# EAGLE design RobotArm4 (EAGLE 4.16)
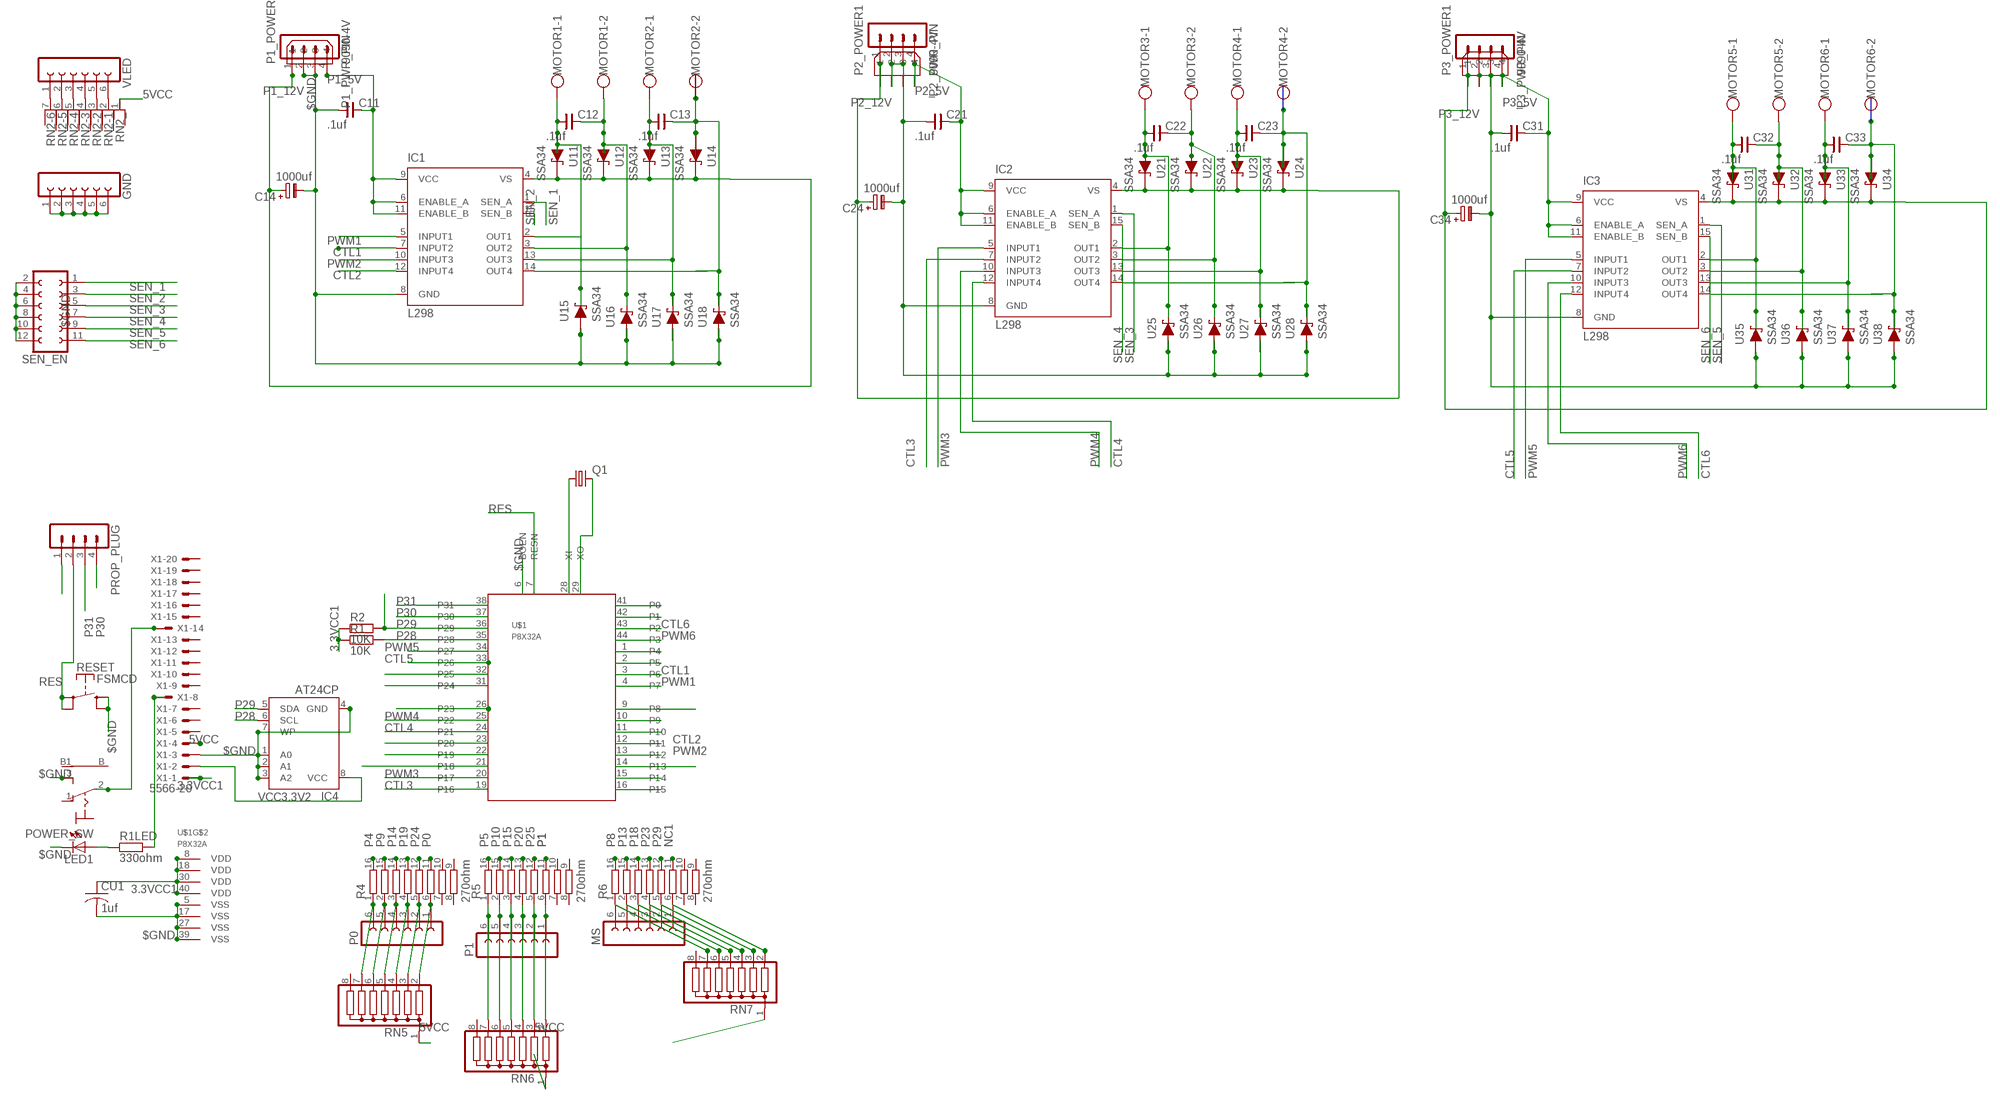
[diagram p0: schematic, sheet 1]

## Parts
C11  .1uf  CNP-1206  [1206]
C12  .1uf  CNP-1206  [1206]
C13  .1uf  CNP-1206  [1206]
C14  1000uf  C-PR-SMD-SV-C  [SV-C]
C21  .1uf  CNP-1206  [1206]
C22  .1uf  CNP-1206  [1206]
C23  .1uf  CNP-1206  [1206]
C24  1000uf  C-PR-SMD-SV-C  [SV-C]
C31  .1uf  CNP-1206  [1206]
C32  .1uf  CNP-1206  [1206]
C33  .1uf  CNP-1206  [1206]
C34  1000uf  C-PR-SMD-SV-C  [SV-C]
CU1  1uf  C-USC1206  [C1206]
GND  FE06-1  [FE06]
IC1  L298  [MULTIWATT-15]
IC2  L298  [MULTIWATT-15]
IC3  L298  [MULTIWATT-15]
IC4  AT24CP  [DIL08]
LED1  LED5MM  [LED5MM]
MOTOR1  W237-102  [W237-102]
MOTOR2  W237-102  [W237-102]
MOTOR3  W237-102  [W237-102]
MOTOR4  W237-102  [W237-102]
MOTOR5  W237-102  [W237-102]
MOTOR6  W237-102  [W237-102]
MS  FE06-1  [FE06]
P0  FE06-1  [FE06]
P1  FE06-1  [FE06]
P1_POWER  9090-4V  [9090-4V]
P1_PWR_PIN  MA04-1  [MA04-1]
P2_POWER1  9090-4V  [9090-4V]
P2_PWR_PIN  MA04-1  [MA04-1]
P3_POWER1  9090-4V  [9090-4V]
P3_PWR_PIN  MA04-1  [MA04-1]
POWER_SW  9070-1W  [9070-1W]
PROP_PLUG  MA04-1  [MA04-1]
Q1  CRYSTALHC49S  [HC49/S]
R1  10K  RESISTOR_1206  [RESC3115X70N]
R1LED  330ohm  RESISTOR_1206  [RESC3115X70N]
R2  10K  RESISTOR_1206  [RESC3115X70N]
R4  270ohm  2NBS16-8  [SO16]
R5  270ohm  2NBS16-8  [SO16]
R6  270ohm  2NBS16-8  [SO16]
RESET  FSMCD  [FSMCD]
RN2  RNX6  [RN-7]
RN5  G07R  [SIL8]
RN6  G07R  [SIL8]
RN7  G07R  [SIL8]
SEN_EN  FE06-2  [FE06-2]
U11  SSA34  [SMA]
U12  SSA34  [SMA]
U13  SSA34  [SMA]
U14  SSA34  [SMA]
U15  SSA34  [SMA]
U16  SSA34  [SMA]
U17  SSA34  [SMA]
U18  SSA34  [SMA]
U21  SSA34  [SMA]
U22  SSA34  [SMA]
U23  SSA34  [SMA]
U24  SSA34  [SMA]
U25  SSA34  [SMA]
U26  SSA34  [SMA]
U27  SSA34  [SMA]
U28  SSA34  [SMA]
U31  SSA34  [SMA]
U32  SSA34  [SMA]
U33  SSA34  [SMA]
U34  SSA34  [SMA]
U35  SSA34  [SMA]
U36  SSA34  [SMA]
U37  SSA34  [SMA]
U38  SSA34  [SMA]
U$1  P8X32A  [LQFP-44]
VLED  FE06-1  [FE06]
X1  5566-20  [5566-20]

## Nets
3.3VCC1: CU1.1 R1.1 R2.1 U$1.8(VDD) U$1.18(VDD) U$1.30(VDD) U$1.40(VDD) X1.1
5VCC: RN2.1 RN5.1 RN6.1 RN7.1 X1.4
$GND: C11.P$1 C14.- C21.P$1 C24.- C31.P$1 C34.- CU1.2 GND.1 GND.2 GND.3 GND.4 GND.5 GND.6 IC1.8(GND) IC2.8(GND) IC3.8(GND) IC4.1(A0) IC4.2(A1) IC4.3(A2) IC4.4(GND) IC4.7(WP) LED1.K(C) P1_POWER.2 P1_POWER.3 P1_PWR_PIN.2 P1_PWR_PIN.3 P2_POWER1.2 P2_POWER1.3 P2_PWR_PIN.2 P2_PWR_PIN.3 P3_POWER1.2 P3_POWER1.3 P3_PWR_PIN.2 P3_PWR_PIN.3 POWER_SW.3(S) PROP_PLUG.1 RESET.P$3(S) RESET.P$4(S) SEN_EN.2 SEN_EN.4 SEN_EN.6 SEN_EN.8 SEN_EN.10 SEN_EN.12 U15.2(A) U16.2(A) U17.2(A) U18.2(A) U25.2(A) U26.2(A) U27.2(A) U28.2(A) U35.2(A) U36.2(A) U37.2(A) U38.2(A) U$1.5(VSS) U$1.6(BOEN) U$1.17(VSS) U$1.27(VSS) U$1.39(VSS) X1.3
CTL1: IC1.7(INPUT2) U$1.3(P6)
CTL2: IC1.12(INPUT4) U$1.12(P11)
CTL3: IC2.7(INPUT2) U$1.19(P16)
CTL4: IC2.12(INPUT4) U$1.24(P21)
CTL5: IC3.7(INPUT2) U$1.33(P26)
CTL6: IC3.12(INPUT4) U$1.43(P2)
M5GND: C13.P$2 IC1.14(OUT4) MOTOR2.2 U14.2(A) U18.1(C)
M5GND1: C23.P$2 IC2.14(OUT4) MOTOR4.2 U24.2(A) U28.1(C)
M5GND2: C33.P$2 IC3.14(OUT4) MOTOR6.2 U34.2(A) U38.1(C)
M5VCC: C13.P$1 IC1.13(OUT3) MOTOR2.1 U13.2(A) U17.1(C)
M5VCC1: C23.P$1 IC2.13(OUT3) MOTOR4.1 U23.2(A) U27.1(C)
M5VCC2: C33.P$1 IC3.13(OUT3) MOTOR6.1 U33.2(A) U37.1(C)
M6GND: C12.P$2 IC1.3(OUT2) MOTOR1.2 U12.2(A) U16.1(C)
M6GND1: C22.P$2 IC2.3(OUT2) MOTOR3.2 U22.2(A) U26.1(C)
M6GND2: C32.P$2 IC3.3(OUT2) MOTOR5.2 U32.2(A) U36.1(C)
M6VCC: C12.P$1 IC1.2(OUT1) MOTOR1.1 U11.2(A) U15.1(C)
M6VCC1: C22.P$1 IC2.2(OUT1) MOTOR3.1 U21.2(A) U25.1(C)
M6VCC2: C32.P$1 IC3.2(OUT1) MOTOR5.1 U31.2(A) U35.1(C)
N$1: RN2.2 VLED.6
N$2: RN2.3 VLED.5
N$3: POWER_SW.2(P) X1.14
N$4: R1LED.2 X1.8
N$5: RN2.4 VLED.4
N$6: LED1.A R1LED.1
N$7: P1.1 R5.6 RN6.2
N$8: RN2.5 VLED.3
N$9: RN2.6 VLED.2
N$10: RN2.7 VLED.1
N$11: P1.2 R5.5 RN6.3
N$12: P0.3 R4.4 RN5.4
N$13: Q1.2 U$1.29(XO)
N$14: Q1.1 U$1.28(XI)
N$15: P0.4 R4.3 RN5.5
N$16: P0.5 R4.2 RN5.6
N$17: P0.6 R4.1 RN5.7
N$18: P1.3 R5.4 RN6.4
N$19: P1.4 R5.3 RN6.5
N$20: P1.5 R5.2 RN6.6
N$21: P1.6 R5.1 RN6.7
N$22: MS.6 R6.1 RN7.7
N$23: MS.5 R6.2 RN7.6
N$24: MS.4 R6.3 RN7.5
N$25: MS.3 R6.4 RN7.4
N$26: MS.2 R6.5 RN7.3
N$27: MS.1 R6.6 RN7.2
NC1: R6.11
P0: R4.11 U$1.41(P0)
P0_1: P0.1 R4.6 RN5.2
P0_2: P0.2 R4.5 RN5.3
P1: R5.11 U$1.42(P1)
P1_5V: C11.P$2 IC1.6(ENABLE_A) IC1.9(VCC) IC1.11(ENABLE_B) P1_POWER.4 P1_PWR_PIN.4
P1_12V: C14.+ IC1.4(VS) P1_POWER.1 P1_PWR_PIN.1 U11.1(C) U12.1(C) U13.1(C) U14.1(C)
P2_5V: C21.P$2 IC2.6(ENABLE_A) IC2.9(VCC) IC2.11(ENABLE_B) P2_POWER1.4 P2_PWR_PIN.4
P2_12V: C24.+ IC2.4(VS) P2_POWER1.1 P2_PWR_PIN.1 U21.1(C) U22.1(C) U23.1(C) U24.1(C)
P3_5V: C31.P$2 IC3.6(ENABLE_A) IC3.9(VCC) IC3.11(ENABLE_B) P3_POWER1.4 P3_PWR_PIN.4
P3_12V: C34.+ IC3.4(VS) P3_POWER1.1 P3_PWR_PIN.1 U31.1(C) U32.1(C) U33.1(C) U34.1(C)
P4: R4.16 U$1.1(P4)
P5: R5.16 U$1.2(P5)
P8: R6.16 U$1.9(P8)
P9: R4.15 U$1.10(P9)
P10: R5.15 U$1.11(P10)
P13: R6.15 U$1.14(P13)
P14: R4.14 U$1.15(P14)
P15: R5.14 U$1.16(P15)
P18: R6.14 U$1.21(P18)
P19: R4.13 U$1.22(P19)
P20: R5.13 U$1.23(P20)
P23: R6.13 U$1.26(P23)
P24: R4.12 U$1.31(P24)
P25: R5.12 U$1.32(P25)
P28: IC4.6(SCL) R1.2 U$1.35(P28)
P29: IC4.5(SDA) R2.2 R6.12 U$1.36(P29)
P30: PROP_PLUG.4 U$1.37(P30)
P31: PROP_PLUG.3 U$1.38(P31)
PWM1: IC1.5(INPUT1) U$1.4(P7)
PWM2: IC1.10(INPUT3) U$1.13(P12)
PWM3: IC2.5(INPUT1) U$1.20(P17)
PWM4: IC2.10(INPUT3) U$1.25(P22)
PWM5: IC3.5(INPUT1) U$1.34(P27)
PWM6: IC3.10(INPUT3) U$1.44(P3)
RES: PROP_PLUG.2 RESET.P$1(P) RESET.P$2(P) U$1.7(RESN)
SEN_1: IC1.1(SEN_A) SEN_EN.1
SEN_2: IC1.15(SEN_B) SEN_EN.3
SEN_3: IC2.1(SEN_A) SEN_EN.5
SEN_4: IC2.15(SEN_B) SEN_EN.7
SEN_5: IC3.1(SEN_A) SEN_EN.9
SEN_6: IC3.15(SEN_B) SEN_EN.11
VCC3.3V2: IC4.8(VCC) X1.2
Unconnected: POWER_SW.1(O) POWER_SW.B POWER_SW.B1 R4.7 R4.8 R4.9 R4.10 R5.7 R5.8 R5.9 R5.10 R6.7 R6.8 R6.9 R6.10 RN5.8 RN6.8 RN7.8 X1.5 X1.6 X1.7 X1.9 X1.10 X1.11 X1.12 X1.13 X1.15 X1.16 X1.17 X1.18 X1.19 X1.20

## Buses
B$1

## Library data of the parts
C11-C13 C21-C23 C31-C33 = zz-cap-master:CNP-: NON-POLARIZED CAP
C14 C24 C34 = zz-cap-pan40:C-PR: POLARIZED ELECTROLYTIC/TANTALUM
CU1 = zz-rcl:C-US: CAPACITOR, American symbol
GND MS P0 P1 VLED = con-lsta:FE06-1: FEMALE HEADER
IC1-IC3 = zz-st-microelectronics:L298: DUAL FULL-BRIDGE DRIVER
IC4 = atmel:AT24C*: 2-wire serial EEPROM
LED1 = led:LED: LED OSRAM: - CHIPLED LG R971, LG N971, LY N971, LG Q971, LY Q971, LO R971, LY R971 LH N974, LH R974 LS Q976, LO Q976, LY Q976 LO Q996 - Hyper CHIPLED LW Q18S LB Q993, LB Q99A, LB R99A - SideLED LS A670, LO A670, LY A670, LG A670, LP A670 LB A673, LV A673, LT A673, LW A673 LH A674 LY A675 LS A676, LA A676, LO A676, LY A676, LW A676 LS A679, LY A679, LG A679 - Hyper Micro SIDELED® LS Y876, LA Y876, LO Y876, LY Y876 LT Y87S - SmartLED LW L88C, LW L88S LB L89C, LB L89S, LG L890 LS L89K, LO L89K, LY L89K LS L896, LA L896, LO L896, LY L896 - TOPLED LS T670, LO T670, LY T670, LG T670, LP T670 LSG T670, LSP T670, LSY T670, LOP T670, LYG T670 LG T671, LOG T671, LSG T671 LB T673, LV T673, LT T673, LW T673 LH T674 LS T676, LA T676, LO T676, LY T676, LB T676, LH T676, LSB T676, LW T676 LB T67C, LV T67C, LT T67C, LS T67K, LO T67K, LY T67K, LW E67C LS E67B, LA E67B, LO E67B, LY E67B, LB E67C, LV E67C, LT E67C LW T67C LS T679, LY T679, LG T679 LS T770, LO T770, LY T770, LG T770, LP T770 LB T773, LV T773, LT T773, LW T773 LH T774 LS E675, LA E675, LY E675, LS T675 LS T776, LA T776, LO T776, LY T776, LB T776 LHGB T686 LT T68C, LB T68C - Hyper Mini TOPLED® LB M676 - Mini TOPLED Santana® LG M470 LS M47K, LO M47K, LY M47K Source: http://www.osram.convergy.de - LUMILED® LXK2-PW12-R00, LXK2-PW12-S00, LXK2-PW14-U00, LXK2-PW14-V00 LXK2-PM12-R00, LXK2-PM12-S00, LXK2-PM14-U00 LXK2-PE12-Q00, LXK2-PE12-R00, LXK2-PE12-S00, LXK2-PE14-T00, LXK2-PE14-U00 LXK2-PB12-K00, LXK2-PB12-L00, LXK2-PB12-M00, LXK2-PB14-N00, LXK2-PB14-P00, LXK2-PB14-Q00 LXK2-PR12-L00, LXK2-PR12-M00, LXK2-PR14-Q00, LXK2-PR14-R00 LXK2-PD12-Q00, LXK2-PD12-R00, LXK2-PD12-S00 LXK2-PH12-R00, LXK2-PH12-S00 LXK2-PL12-P00, LXK2-PL12-Q00, LXK2-PL12-R00 Source: www.luxeon.com
MOTOR1-MOTOR6 = con-wago-500:W237-102: WAGO SCREW CLAMP
P1_POWER P2_POWER1 P3_POWER1 = con-thomas-betts:9090-4: Disk Drive Power four position Source: Thomas & Betts Electronic Interconnects Eiropean Edition 1998
P1_PWR_PIN P2_PWR_PIN P3_PWR_PIN PROP_PLUG = con-lstb:MA04-1: PIN HEADER
POWER_SW = switch:9070-1W: TOGGLE SWITCH Marquardt
Q1 = crystal:CRYSTAL: CRYSTAL
R1 R1LED R2 = zz-ipc-7351-resistor:RESISTOR_
R4-R6 = resistor-bourns:2NBS16-8: BOURNS RESISTOR NETWORK
RESET = zz-switch-misc:FSMCD: TYCO SWITCH
RN2 = resistor-net:RNX6: RESISTOR NETWORK
RN5-RN7 = resistor-sil:G07R: SIL RESISTOR
SEN_EN = con-lsta:FE06-2: FEMALE HEADER
U11-U18 U21-U28 U31-U38 = diode-20CJQ030:SSA34
U$1 = propeller:P8X32A
X1 = con-molex:5566-20: Mini FIT connector 20 pol ATX PC-Motherboard Power connector Source: http://www.molex.com

## Board
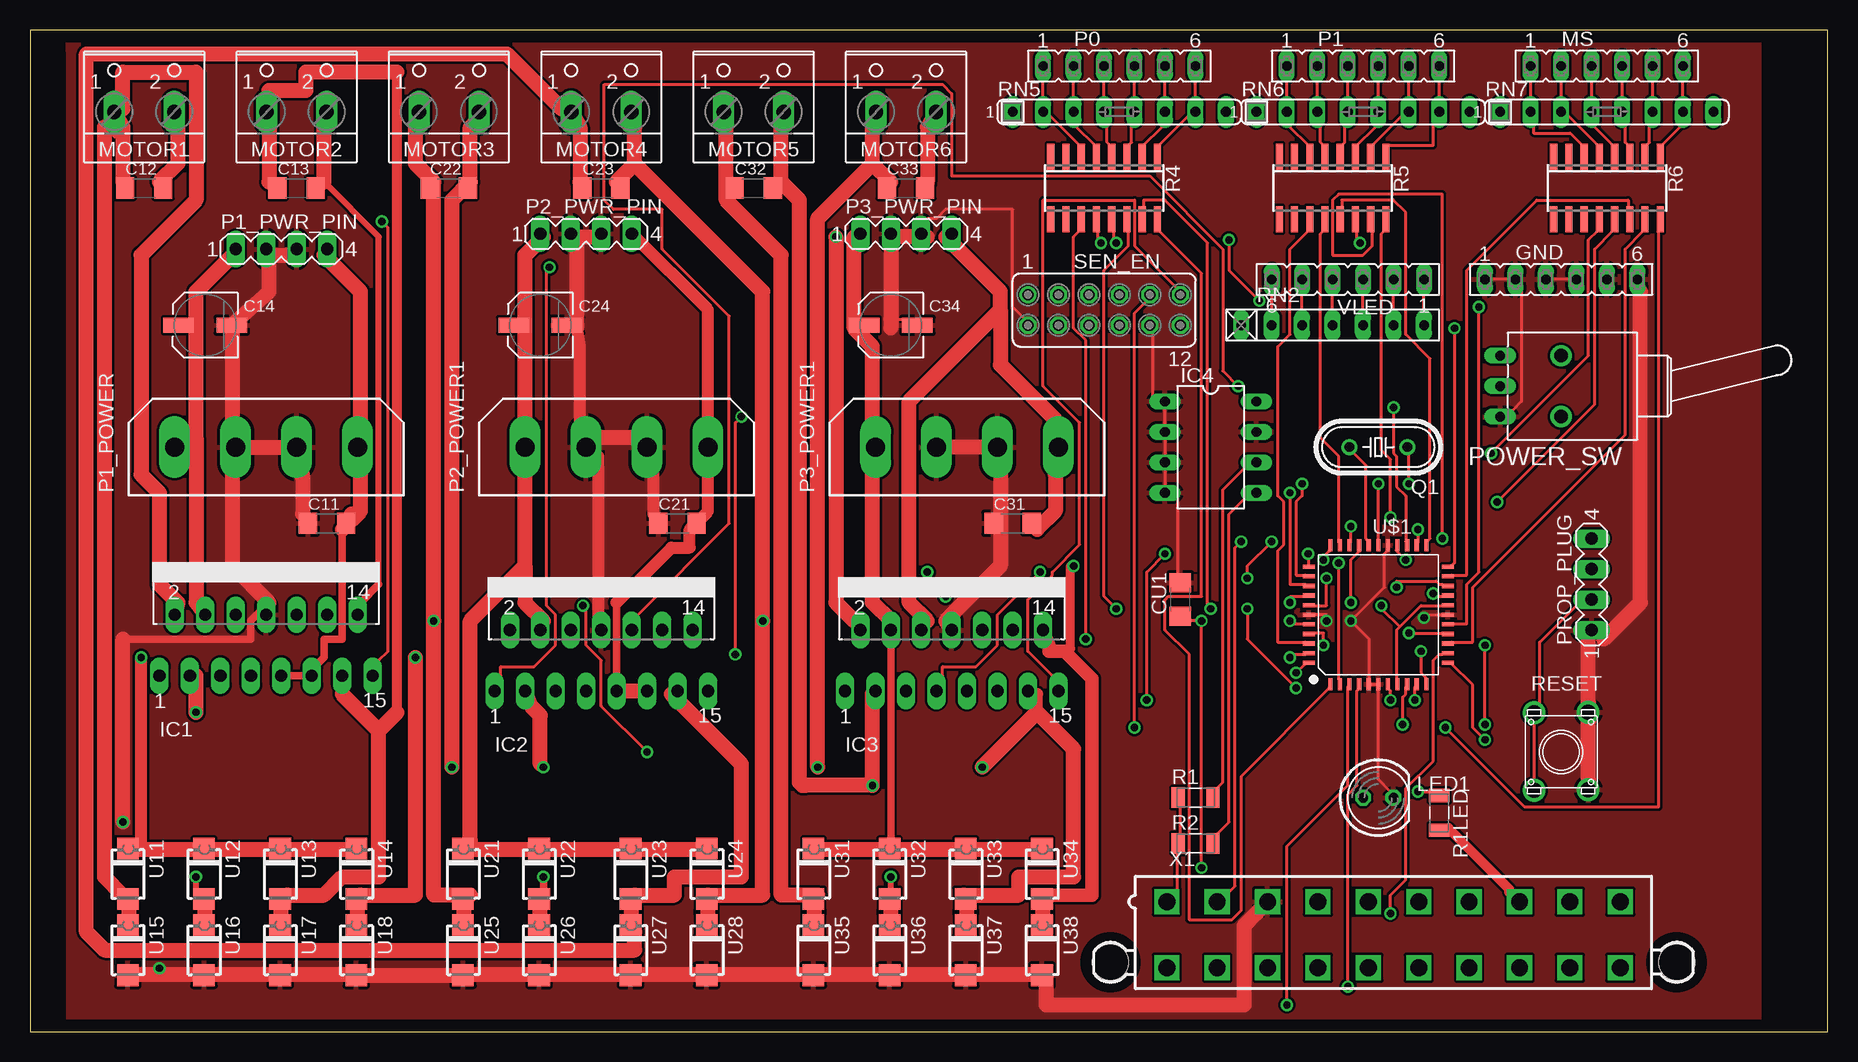
[diagram p1: board, top side]
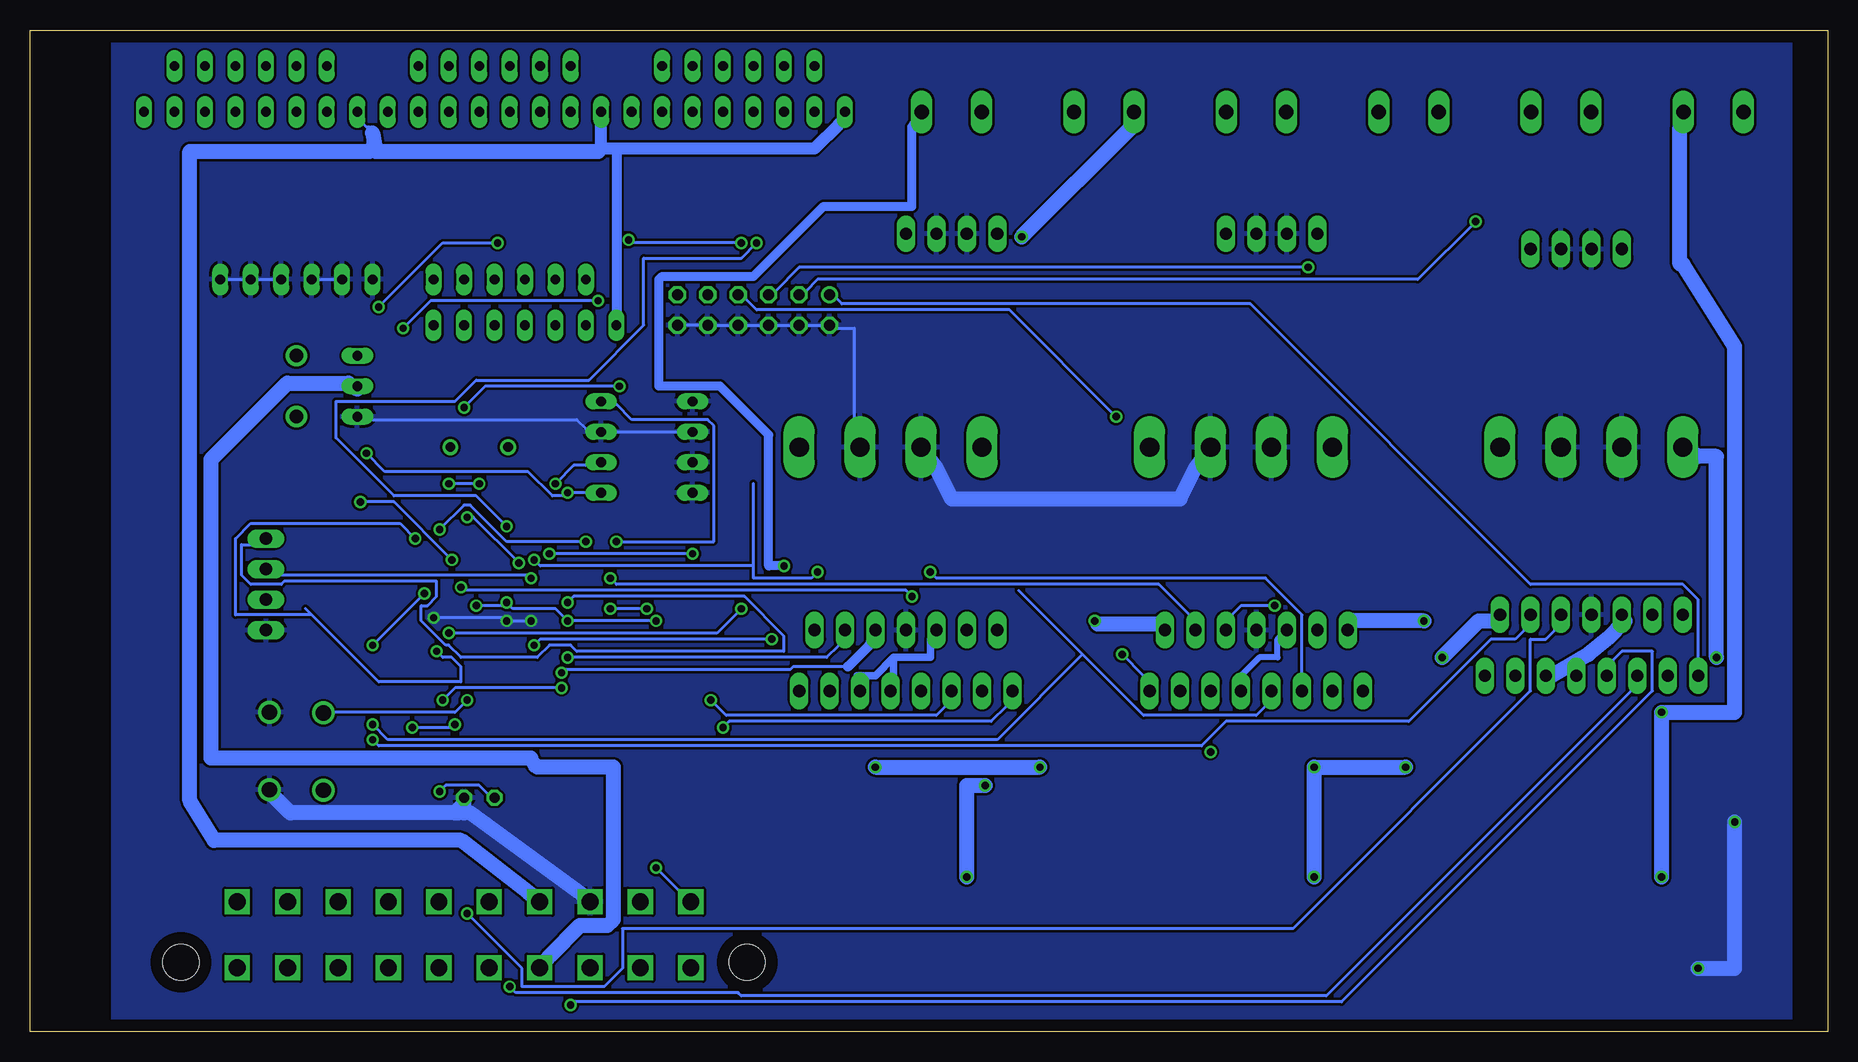
[diagram p2: board, bottom side, seen from below]

Size 149.84 x 83.49 mm. Coordinates in mm from the lower left corner, seen from the top.
Outline: 0,0 149.84,0 149.84,83.49 0,83.49 0,0
Copper layers (1*16): Top 0.035mm / dielectric 1.5mm / Bottom 0.035mm
Design rules "default": minimum track width 10mil, minimum drill 24mil, track to track 8mil, track to pad 8mil, pad to pad 8mil, via to via 8mil, smd to smd 8mil, copper to edge 40mil, drill to drill 8mil, minimum pad ring 10mil, minimum via ring 8mil, stop-mask expansion 4mil, vias tented up to drill 0mil, thermal gap 10mil

### Footprints (pad centres in the part's own frame; a part is rotated, then mirrored left to right if it is on the bottom)
1206 = smd 1.524 x 1.778: P$1 -1.587,0; P$2 1.587,0
SV-C = smd 2.54 x 1.27: + -2.223,0; - 2.223,0
C1206 = smd 1.6 x 1.8: 1 -1.4,0; 2 1.4,0
FE06 = drill 0.813 long: 1 -6.35,0; 2 -3.81,0; 3 -1.27,0; 4 1.27,0; 5 3.81,0; 6 6.35,0
MULTIWATT-15 = drill 1.016 long: 1 -8.89,-7.62; 2 -7.62,-2.54; 3 -6.35,-7.62; 4 -5.08,-2.54; 5 -3.81,-7.62; 6 -2.54,-2.54; 7 -1.27,-7.62; 8 0,-2.54; 9 1.27,-7.62; 10 2.54,-2.54; 11 3.81,-7.62; 12 5.08,-2.54; 13 6.35,-7.62; 14 7.62,-2.54; 15 8.89,-7.62
DIL08 = drill 0.813 long: 1 -3.81,-3.81; 2 -1.27,-3.81; 3 1.27,-3.81; 4 3.81,-3.81; 5 3.81,3.81; 6 1.27,3.81; 7 -1.27,3.81; 8 -3.81,3.81
LED5MM = drill 0.813 octagon: A -1.27,0; K 1.27,0
W237-102 = drill 1.194 long: 1 -2.5,-1.27; 2 2.5,-1.27
9090-4V = drill 1.6 pad 2.6 long: 1 -7.62,0; 2 -2.54,0; 3 2.54,0; 4 7.62,0
MA04-1 = drill 1.016 long: 1 -3.81,0; 2 -1.27,0; 3 1.27,0; 4 3.81,0
9070-1W = drill 0.813 long: 1 5.08,-2.54; 2 5.08,0; 3 5.08,2.54 | drill 1.118 pad 1.778 round: B 0,-2.54; B1 0,2.54
HC49/S = drill 0.813 round: 1 -2.413,0; 2 2.413,0
RESC3115X70N = smd 1.1 x 1.7: 1 -1.45,0; 2 1.45,0
SO16 = smd 0.6 x 2.2: 1 -4.445,-2.6; 2 -3.175,-2.6; 3 -1.905,-2.6; 4 -0.635,-2.6; 5 0.635,-2.6; 6 1.905,-2.6; 7 3.175,-2.6; 8 4.445,-2.6; 9 4.445,2.6; 10 3.175,2.6; 11 1.905,2.6; 12 0.635,2.6; 13 -0.635,2.6; 14 -1.905,2.6; 15 -3.175,2.6; 16 -4.445,2.6
FSMCD = drill 1.27 round: P$1 -2.25,3.25; P$2 -2.25,-3.2; P$3 2.25,3.3; P$4 2.25,-3.15
RN-7 = drill 0.813 long: 1 -7.62,0; 2 -5.08,0; 3 -2.54,0; 4 0,0; 5 2.54,0; 6 5.08,0; 7 7.62,0
SIL8 = drill 0.813 long: 1 -8.89,0; 2 -6.35,0; 3 -3.81,0; 4 -1.27,0; 5 1.27,0; 6 3.81,0; 7 6.35,0; 8 8.89,0
FE06-2 = drill 0.914 round: 1 -6.35,1.27 | drill 0.914 octagon: 2 -6.35,-1.27; 3 -3.81,1.27; 4 -3.81,-1.27; 5 -1.27,1.27; 6 -1.27,-1.27; 7 1.27,1.27; 8 1.27,-1.27; 9 3.81,1.27; 10 3.81,-1.27; 11 6.35,1.27; 12 6.35,-1.27
SMA = smd 1.8 x 1.8: 1 -2.1,-0.1; 2 2.1,-0.1
LQFP-44 = smd 0.35 x 1: 1 -4,-5.8; 2 -3.2,-5.8; 3 -2.4,-5.8; 4 -1.6,-5.8; 5 -0.8,-5.8; 6 0,-5.8; 7 0.8,-5.8; 8 1.6,-5.8; 9 2.4,-5.8; 10 3.2,-5.8; 11 4,-5.8; 23 4,5.8; 24 3.2,5.8; 25 2.4,5.8; 26 1.6,5.8; 27 0.8,5.8; 28 0,5.8; 29 -0.8,5.8; 30 -1.6,5.8; 31 -2.4,5.8; 32 -3.2,5.8; 33 -4,5.8 | smd 1 x 0.35: 12 5.8,-4; 13 5.8,-3.2; 14 5.8,-2.4; 15 5.8,-1.6; 16 5.8,-0.8; 17 5.8,0; 18 5.8,0.8; 19 5.8,1.6; 20 5.8,2.4; 21 5.8,3.2; 22 5.8,4; 34 -5.8,4; 35 -5.8,3.2; 36 -5.8,2.4; 37 -5.8,1.6; 38 -5.8,0.8; 39 -5.8,0; 40 -5.8,-0.8; 41 -5.8,-1.6; 42 -5.8,-2.4; 43 -5.8,-3.2; 44 -5.8,-4
5566-20 = drill 1.4 square: 1 18.9,-2.75; 2 14.7,-2.75; 3 10.5,-2.75; 4 6.3,-2.75; 5 2.1,-2.75; 6 -2.1,-2.75; 7 -6.3,-2.75; 8 -10.5,-2.75; 9 -14.7,-2.75; 10 -18.9,-2.75; 11 18.9,2.75; 12 14.7,2.75; 13 10.5,2.75; 14 6.3,2.75; 15 2.1,2.75; 16 -2.1,2.75; 17 -6.3,2.75; 18 -10.5,2.75; 19 -14.7,2.75; 20 -18.9,2.75 | hole 3: 23.6,2.29; -23.6,2.29

### Placement (x,y rotation side)
C11  24.76,42.38 0 top
C12  9.52,70.32 0 top
C13  22.22,70.32 0 top
C14  14.6,58.89 0 top
C21  53.97,42.38 0 top
C22  34.92,70.32 0 top
C23  47.62,70.32 0 top
C24  42.54,58.89 0 top
C31  81.91,42.38 0 top
C32  60.32,70.32 0 top
C33  73.02,70.32 0 top
C34  71.75,58.89 0 top
CU1  95.88,36.03 90 top
GND  127.63,62.7 0 top
IC1  19.68,37.3 0 top
IC2  47.62,36.03 0 top
IC3  76.83,36.03 0 top
IC4  98.42,48.73 270 top
LED1  112.39,19.52 0 top
MOTOR1  9.52,77.94 0 top
MOTOR2  22.22,77.94 0 top
MOTOR3  34.92,77.94 0 top
MOTOR4  47.62,77.94 0 top
MOTOR5  60.32,77.94 0 top
MOTOR6  73.02,77.94 0 top
MS  131.44,80.48 0 top
P0  90.8,80.48 0 top
P1  111.12,80.48 0 top
P1_POWER  19.68,48.73 0 top
P1_PWR_PIN  20.95,65.24 0 top
P2_POWER1  48.89,48.73 0 top
P2_PWR_PIN  46.35,66.51 0 top
P3_POWER1  78.1,48.73 0 top
P3_PWR_PIN  73.02,66.51 0 top
POWER_SW  127.63,53.81 180 top
PROP_PLUG  130.17,37.3 90 top
Q1  112.39,48.73 180 top
R1  97.15,19.52 0 top
R1LED  117.47,18.25 270 top
R2  97.15,15.71 0 top
R4  89.53,70.32 180 top
R5  108.58,70.32 180 top
R6  131.44,70.32 180 top
RESET  127.63,23.33 0 top
RN2  108.58,58.89 0 top
RN5  90.8,76.67 0 top
RN6  111.12,76.67 0 top
RN7  131.44,76.67 0 top
SEN_EN  89.53,60.16 0 top
U11  8.25,13.17 270 top
U12  14.6,13.17 270 top
U13  20.95,13.17 270 top
U14  27.3,13.17 270 top
U15  8.25,6.82 270 top
U16  14.6,6.82 270 top
U17  20.95,6.82 270 top
U18  27.3,6.82 270 top
U21  36.19,13.17 270 top
U22  42.54,13.17 270 top
U23  50.16,13.17 270 top
U24  56.51,13.17 270 top
U25  36.19,6.82 270 top
U26  42.54,6.82 270 top
U27  50.16,6.82 270 top
U28  56.51,6.82 270 top
U31  65.4,13.17 270 top
U32  71.75,13.17 270 top
U33  78.1,13.17 270 top
U34  84.45,13.17 270 top
U35  65.4,6.82 270 top
U36  71.75,6.82 270 top
U37  78.1,6.82 270 top
U38  84.45,6.82 270 top
U$1  112.39,34.76 0 top
VLED  109.85,62.7 180 top
X1  113.66,8.09 180 top

### Tracks (layer width: path | path; a pad name or v marks a point on that pad's centre or on a via)
3.3VCC1  (via drill 0.61)
  Top 0.254: R1.1 95.88,18.76 95.88,16.47 R2.1 95.63,14.95 95.63,11.65 X1.1 | 114.17,33.74 115.95,35.52 117.72,35.52 U$1.18 | 114.17,33.74 113.91,33.49 113.91,29.43 U$1.8 | v105.02,34.25 105.02,34 106.29,34 U$1.40 | CU1.1 96.64,34.25 v97.66,34.25 v97.66,13.68 | v110.1,35.78 110.1,39.33 110.87,40.09 U$1.30 | 114.17,33.74 112.64,35.27 v112.64,35.52
  Bottom 0.254: v97.66,34.25 v105.02,34.25 106.04,35.27 109.6,35.27 v110.1,35.78 110.36,35.52 v112.64,35.52 | v97.66,13.68 95.63,11.65 X1.1
5VCC
  Bottom 0.254: 82.42,75.65 RN5.1 | 101.98,73.62 102.48,73.37 102.23,73.88 | RN7.1 122.04,75.65 121.79,75.4 121.53,75.4 121.28,74.89
  Bottom 0.762: 121.53,73.37 121.28,74.89
  Bottom 0.813: 100.96,73.62 RN2.1
  Bottom 1.016: 82.42,75.65 84.45,73.62 100.96,73.62 101.98,73.62 | 102.23,73.88 RN6.1
  Bottom 1.27: 121.53,73.37 136.52,73.37 136.52,19.27 134.49,15.96 113.91,15.96 108.33,11.65 X1.4 | 102.48,73.37 121.03,73.37 121.28,74.89
$GND  (via drill 0.61)
  Top 0.254: 66.16,4.79 U35.2 64.64,4.79 | 70.99,4.79 U36.2 72.51,4.79 | 78.86,4.79 U37.2 77.34,4.79 | 83.69,4.79 U38.2 85.21,5.55 | U25.2 36.95,4.79 | 41.78,4.79 U26.2 43.3,4.79 | 50.92,4.79 U27.2 49.4,4.79 | 55.75,4.79 U28.2 57.27,4.79 | U15.2 9.01,4.79 | 13.84,4.79 U16.2 15.36,4.79 | 21.71,4.79 U17.2 20.19,4.79 | 26.54,4.79 U18.2 26.54,5.55 | RESET.P$4 129.92,21.04 | 129.92,25.87 RESET.P$3 129.92,27.39 | 16.89,47.21 17.14,50.76 | 16.89,46.19 P1_POWER.2 | 45.71,57.89 45.59,57.87 C24.- | 71.75,59.4 73.27,59.4 C34.- | P3_PWR_PIN.3 74.8,67.78 75.56,67.78 76.32,68.54 81.91,68.54 81.91,60.41 82.93,59.4 SEN_EN.2 | CU1.2 95.63,38.06 95.63,44.41 IC4.4 IC4.3 IC4.2 IC4.1 93.59,53.05 93.59,58.38 SEN_EN.10 | v108.07,34.25 108.07,34.76 U$1.39 | U$1.27 113.15,40.09 112.9,39.84 112.9,37.05 v110.1,34.25 111.63,32.73 111.63,29.43 U$1.5 111.63,28.92 112.39,28.92 U$1.6 112.39,21.04 113.41,20.03 LED1.K | v116.2,34.51 116.2,34.76 U$1.17 | GND.4 GND.3 | POWER_SW.3 123.57,51.78 124.33,52.54 124.33,61.68 GND.2 GND.1 | 129.92,32.98 PROP_PLUG.1 131.44,33.49 131.69,33.24
  Top 0.406: U25.2 36.19,4.72 36.19,4.28
  Top 0.508: P3_PWR_PIN.3 74.8,66.26 | 71.75,66.26 P3_PWR_PIN.2 | 16.89,47.21 16.89,46.19 16.89,46.44 | 47.37,66.26 P2_PWR_PIN.3 | 45.59,66.26 P2_PWR_PIN.2 | 47.37,34.25 IC2.8 | 10.79,4.79 v10.79,5.3
  Top 0.61: 7.74,32.73 18.41,32.73 18.41,34.25 19.93,35.78 IC1.8 | P1_POWER.2 P1_POWER.3 P1_POWER.2 | P1_POWER.2 17.14,50.76 17.14,51.27 | P1_POWER.2 17.14,46.19
  Top 0.762: RESET.P$4 129.66,19.77 | U38.2 84.7,4.53
  Top 0.813: 51.94,43.14 C21.P$1 | 19.93,64.73 P1_PWR_PIN.2
  Top 1.016: 21.46,64.73 P1_PWR_PIN.3 | P2_PWR_PIN.2 45.84,66.26 | 51.94,43.14 51.94,46.44 P2_POWER1.3 50.41,49.49 | 47.37,34.25 47.37,47.97 P2_POWER1.2 | 47.37,49.49 P2_POWER1.2 | 45.59,58.64 45.71,57.89 45.84,57.11 45.84,51.02 P2_POWER1.2 | 134.23,61.68 GND.6 | 22.73,43.14 C11.P$1
  Top 1.27: 66.16,4.79 70.99,4.79 | 78.86,4.79 83.69,4.79 | 72.51,4.79 77.34,4.79 | 36.95,4.79 41.78,4.79 | 50.92,4.79 55.75,4.79 | 43.3,4.79 49.4,4.79 | 9.01,4.79 10.79,4.79 13.84,4.79 | 21.71,4.79 26.54,4.79 | 15.36,4.79 20.19,4.79 | U18.2 36.19,4.72 | 129.92,21.04 129.92,25.87 | 129.92,27.39 129.92,32.98 | 74.8,66.26 71.75,66.26 71.75,59.4 71.75,58.64 | 80.89,41.87 80.89,46.44 P3_POWER1.3 P3_POWER1.2 | 80.89,41.87 80.89,38.82 76.32,34.25 IC3.8 | 80.89,41.87 C31.P$1 | 21.46,64.73 19.93,64.73 19.93,61.68 C14.- 16.89,58.64 16.89,47.21 16.89,38.82 19.93,35.78 | 45.84,66.26 47.37,66.26 | 45.59,58.64 45.59,66.26 | 50.41,49.49 47.37,49.49 | 134.23,61.68 134.23,35.78 131.69,33.24 131.19,32.73 | v7.74,17.49 7.74,32.73 | 57.27,4.79 64.64,4.79 | P1_POWER.2 P1_POWER.3 22.73,46.19 22.73,43.14 | 84.7,4.53 84.7,2.25 101.21,2.25 101.21,8.85 102.23,9.87 X1.3
  Bottom 0.254: SEN_EN.12 SEN_EN.10 SEN_EN.8 SEN_EN.6 SEN_EN.4 SEN_EN.2 82.67,58.64 81.15,58.64 81.15,51.27 P3_POWER1.3 | IC4.2 IC4.7 103.5,50.25 104.26,51.02 121.28,51.02 POWER_SW.3 | v108.07,34.25 v110.1,34.25 110.36,34.51 v116.2,34.51 | GND.6 GND.5 GND.4 | GND.3 GND.2
  Bottom 0.762: 113.66,19.01 LED1.K | 129.66,19.77 RESET.P$4 | 113.66,18.25 114.04,18.63
  Bottom 1.27: v7.74,17.49 7.74,5.3 v10.79,5.3 | P3_POWER1.2 74.29,46.95 73.02,44.41 53.97,44.41 52.7,46.95 P2_POWER1.3 | 114.17,18.25 113.66,18.25 113.15,18.25 103.75,11.39 X1.3 | 113.66,19.01 114.04,18.63 114.42,18.25 128.14,18.25 129.66,19.77
  pour Bottom: 3.17,83.02 3.17,0.47 142.87,0.47 142.87,14.44 142.87,83.02
  pour Top: 3.17,83.02 3.17,0.47 144.14,0.47 144.14,1.74 144.14,83.02 3.17,83.02 3.17,81.75
CTL1  (via drill 0.61)
  Top 0.254: v104.77,2.25 104.77,15.46 109.85,20.54 109.85,28.66 U$1.3
  Bottom 0.254: v104.77,2.25 104.52,2.5 40.51,2.5 14.6,28.41 14.6,31.71 17.14,31.71 17.9,30.95 IC1.7
CTL2  (via drill 0.61)
  Top 0.254: v121.28,24.35 120.26,25.36 120.26,28.92 118.49,30.7 U$1.12
  Bottom 0.254: IC1.12 25.27,33.49 26.03,32.73 28.06,32.73 34.92,25.87 50.16,25.87 52.19,23.84 120.77,23.84 v121.28,24.35
CTL3  (via drill 0.61)
  Top 0.254: v116.96,36.54 116.96,36.28 117.72,36.28 U$1.19 | v121.28,25.62 v121.28,32.22
  Bottom 0.254: 62.1,31.46 57.02,26.38 47.62,26.38 46.86,27.14 IC2.7 | 62.1,31.46 67.43,36.79 | v121.28,32.22 v116.96,36.54 | v121.28,25.62 120.01,24.35 69.21,24.35 62.1,31.46
CTL4  (via drill 0.61)
  Top 0.254: v115.69,41.87 115.69,40.86 U$1.24 | v103.5,40.86 101.47,38.82 v101.47,37.81
  Bottom 0.254: v115.69,41.87 113.66,43.9 113.15,43.9 110.1,40.86 v103.5,40.86 | v101.47,37.81 100.96,37.3 55.75,37.3 53.21,34.76 IC2.12
CTL5  (via drill 0.61)
  Top 0.254: v84.2,38.32 80.64,34.76 80.64,32.22 78.86,30.44 76.07,30.44 76.07,29.68 IC3.7 | v107.82,39.33 107.82,39.59 108.33,40.09 U$1.33
  Bottom 0.254: 89.53,38.82 89.53,37.81 84.7,37.81 v84.2,38.32 | 89.53,38.82 89.53,45.68 | v107.82,39.33 107.31,38.82 89.53,38.82
CTL6  (via drill 0.61)
  Top 0.254: v105.02,31.2 105.02,31.46 106.29,31.46 U$1.43
  Bottom 0.254: IC3.12 82.42,32.22 83.43,31.2 v105.02,31.2
M5GND  (via drill 0.61)
  Top 0.254: U18.1 27.3,9.61 | 27.3,10.38 U14.2
  Top 0.508: U14.2 27.55,11.39 | 29.08,37.3 29.08,66.26 24.51,70.83 C13.P$2
  Top 0.61: 29.08,37.3 27.55,35.78 IC1.14
  Top 1.27: 27.3,9.61 27.3,10.38 | 24.51,70.83 24.51,75.4 MOTOR2.2 | 27.55,11.39 32.13,11.39 v32.13,31.2
  Bottom 0.61: 27.55,34.25 IC1.14
  Bottom 1.27: v32.13,31.2 29.08,34.25 27.55,34.25
M5GND1  (via drill 0.61)
  Top 0.254: U28.1 56.51,9.61 | 56.51,10.38 U24.2
  Top 0.508: 48.89,70.83 C23.P$2 | U24.2 56.51,11.39
  Top 1.016: 50.41,75.4 MOTOR4.2
  Top 1.27: 56.51,9.61 56.51,10.38 | 50.41,72.35 48.89,70.83 | 50.41,72.35 50.41,75.4 | 56.51,11.39 61.08,11.39 v61.08,34.25 61.08,61.68 50.41,72.35
  Bottom 0.254: v61.08,34.25 60.83,34
  Bottom 1.27: 60.83,34 55.75,34 IC2.14
M5GND2  (via drill 0.61)
  Top 0.254: U38.1 84.45,9.61 | 84.45,10.38 U34.2
  Top 0.762: v86.99,38.82 86.74,38.82 86.74,31.97 86.36,31.59
  Top 1.143: U34.2 85.21,11.39 88.51,11.39 88.51,29.43 86.36,31.59 86.23,31.71 84.96,31.71 84.96,32.22 IC3.14
  Top 1.27: 84.45,9.61 84.45,10.38 | C33.P$2 74.8,70.83 74.8,75.4 MOTOR6.2
  Bottom 0.508: IC3.14 83.94,32.73
  Bottom 0.762: v86.99,38.82 88.26,38.82 88.26,49.75 92.32,53.81 97.4,53.81 97.4,62.7 97.15,62.95 89.53,62.95 83.69,68.8 76.32,68.8 76.32,75.4 MOTOR6.2
M5VCC
  Top 0.254: U17.1 20.95,9.61 | 20.95,10.38 U13.2
  Top 0.508: 19.93,70.83 C13.P$1 | U13.2 21.46,11.39
  Top 0.813: 26.03,28.16 IC1.13 | 30.6,26.63 30.6,79.97
  Top 1.27: 20.95,9.61 20.95,10.38 | 19.93,70.83 19.93,75.4 MOTOR2.1 19.93,78.45 22.98,78.45 22.98,79.97 30.6,79.97 | 21.46,11.39 24.51,11.39 26.03,12.92 29.08,12.92 29.08,25.11 | 29.08,25.11 26.03,28.16 | 29.08,25.11 30.6,26.63
M5VCC1
  Top 0.254: U27.1 50.16,9.61 | 50.16,10.38 U23.2
  Top 0.508: 45.84,70.83 C23.P$1 | U23.2 50.41,11.39 | 50.41,8.34 U27.1
  Top 0.61: 53.46,28.16 IC2.13
  Top 1.016: 44.32,76.92 MOTOR4.1
  Top 1.27: 50.16,9.61 50.16,10.38 | 45.84,70.83 45.84,75.4 MOTOR4.1 | 50.41,11.39 53.72,11.39 53.72,12.92 59.3,12.92 59.3,22.31 53.46,28.16 | 44.32,76.92 39.75,81.5 4.69,81.5 4.69,8.34 6.22,6.82 50.41,6.82 50.41,8.34
M5VCC2  (via drill 0.61)
  Top 0.254: U37.1 78.1,9.61 | 78.1,10.38 U33.2
  Top 0.508: 71.75,70.83 C33.P$1 | U33.2 77.85,11.39
  Top 1.016: 83.94,26.63 83.94,28.16 IC3.13
  Top 1.27: 78.1,9.61 78.1,10.38 | 70.23,72.35 71.75,70.83 | 70.23,72.35 70.23,75.4 MOTOR6.1 | 77.85,11.39 82.42,11.39 82.42,12.92 86.99,12.92 86.99,23.58 83.94,26.63 v79.37,22.06 | 70.23,72.35 65.65,67.78 v65.65,22.06
  Bottom 1.27: v79.37,22.06 v65.65,22.06
M6GND  (via drill 0.61)
  Top 0.254: U16.1 14.6,9.61 | 14.6,10.38 U12.2
  Top 0.508: 10.79,70.83 C12.P$2 | v13.84,12.92 13.84,11.39 U12.2
  Top 0.813: MOTOR1.2 12.31,75.4
  Top 1.016: 13.84,29.68 IC1.3
  Top 1.27: 14.6,9.61 14.6,10.38 | 10.79,70.83 12.31,72.35 12.31,75.4 | v13.84,26.63 13.84,29.68
  Bottom 0.508: 12.31,75.4 MOTOR1.2
  Bottom 0.61: 12.06,63.97 12.31,63.97
  Bottom 1.27: v13.84,12.92 v13.84,26.63 7.74,26.63 7.74,57.11 12.06,63.97 | 12.31,63.97 12.31,75.4
M6GND1  (via drill 0.61)
  Top 0.254: U26.1 42.54,9.61 | 42.54,10.38 U22.2 | v42.79,22.06 42.54,22.31
  Top 0.508: U22.2 42.79,11.39 | 36.7,70.83 C22.P$2
  Top 0.61: 42.79,11.39 v42.79,12.92
  Top 1.016: 36.7,75.4 MOTOR3.2
  Top 1.27: 42.54,9.61 42.54,10.38 | 36.7,75.4 36.7,70.83 35.17,69.3 v35.17,22.06 | 42.54,22.31 42.54,26.38 41.78,27.14 IC2.3
  Bottom 1.27: v42.79,12.92 v42.79,22.06 v35.17,22.06
M6GND2  (via drill 0.61)
  Top 0.254: U36.1 71.75,9.61 | 71.75,10.38 U32.2 | 64.64,20.54 64.13,20.79
  Top 0.508: v71.75,12.92 71.75,11.39 U32.2 | 70.23,28.16 IC3.3 | 62.61,70.83 C32.P$2
  Top 1.016: 62.61,75.4 MOTOR5.2
  Top 1.27: 71.75,9.61 71.75,10.38 | 62.61,75.4 62.61,70.83 64.13,69.3 64.13,20.79 | 70.23,28.16 v70.23,20.54 64.64,20.54 64.38,20.54
  Bottom 1.27: v71.75,12.92 71.75,20.54 v70.23,20.54
M6VCC
  Top 0.254: C12.P$1 7.23,71.08 | U15.1 8.25,9.61 | 8.25,10.38 U11.2
  Top 0.508: 7.74,70.83 C12.P$1 | U11.2 7.74,11.39 | 6.22,75.4 MOTOR1.1
  Top 0.813: MOTOR1.1 7.74,76.92
  Top 1.016: MOTOR1.1 7.23,74.89
  Top 1.27: 8.25,9.61 8.25,10.38 | 7.74,70.83 7.74,75.4 MOTOR1.1 | 7.74,11.39 6.22,12.92 6.22,75.4 | 7.74,76.92 7.74,79.97 13.84,79.97 13.84,69.3 9.27,64.73 9.27,46.44 10.79,44.92 10.79,37.3 12.31,35.78 IC1.2
M6VCC1  (via drill 0.61)
  Top 0.254: U25.1 36.19,9.61 | 36.19,10.38 U21.2
  Top 0.508: U21.2 36.7,11.39 | 33.65,70.83 C22.P$1
  Top 1.016: 32.13,75.4 MOTOR3.1
  Top 1.27: 36.19,9.61 36.19,10.38 | 32.13,75.4 32.13,72.35 33.65,70.83 v33.65,34.25 33.65,11.39 36.7,11.39
  Bottom 0.508: 39.75,34.25 IC2.2
  Bottom 1.27: v33.65,34.25 39.75,34.25
M6VCC2  (via drill 0.61)
  Top 0.254: U35.1 65.4,9.61 | 65.4,10.38 U31.2
  Top 0.508: U31.2 65.65,11.39 | 58.03,70.83 C32.P$1
  Top 0.813: 68.7,34.25 IC3.2
  Top 1.016: 58.03,75.4 MOTOR5.1
  Top 1.27: 65.4,9.61 65.4,10.38 | 58.03,75.4 58.03,70.83 58.03,69.3 62.61,64.73 62.61,11.39 65.65,11.39 | 68.7,34.25 67.18,35.78 v67.18,66.26
  Bottom 0.508: MOTOR5.1 58.03,75.4
  Bottom 1.27: 58.03,75.4 v67.18,66.26
N$1
  Top 0.254: RN2.2 VLED.6
N$2
  Top 0.254: RN2.3 VLED.5
N$3
  Bottom 0.762: 122.67,53.63 POWER_SW.2 | 107.82,22.31 108.07,22.82
  Bottom 1.27: 122.55,53.56 122.67,53.63 123.31,54.06 128.39,54.06 134.74,47.71 134.74,22.82 108.07,22.82 | X1.14 106.55,6.31 104.01,8.85 101.72,8.85 101.21,9.36 101.21,22.06 107.56,22.06 107.82,22.31
N$4
  Top 0.254: 123.31,11.9 123.31,11.65 | R1LED.2 117.98,16.98 118.23,16.98
  Top 0.813: 118.23,16.98 123.31,11.9 | 123.31,11.65 X1.8
N$5
  Top 0.254: RN2.4 VLED.4
N$6  (via drill 0.61)
  Top 0.254: v115.69,20.03 116.71,20.03 R1LED.1
  Bottom 0.254: v115.69,20.03 115.18,20.54 112.39,20.54 111.63,19.77 LED1.A
N$7
  Top 0.254: R5.6 106.55,73.88 105.02,75.4 RN6.2 P1.1
N$8
  Top 0.254: RN2.5 VLED.3
N$9
  Top 0.254: RN2.6 VLED.2
N$10
  Top 0.254: RN2.7 VLED.1
N$11
  Top 0.254: R5.5 107.82,73.88 107.56,74.13 107.56,75.4 RN6.3 P1.2
N$12
  Top 0.254: R4.4 90.04,73.88 89.78,74.13 89.78,75.4 RN5.4 P0.3
N$13
  Top 0.254: U$1.29 111.63,40.86 111.37,41.11 111.37,47.21 110.36,48.22 Q1.2
N$14  (via drill 0.61)
  Top 0.254: v114.93,45.68 114.93,48.22 Q1.1 | U$1.28 v112.39,45.68
  Bottom 0.254: v112.39,45.68 v114.93,45.68
N$15
  Top 0.254: R4.3 91.56,73.88 91.82,74.13 91.82,75.4 RN5.5 P0.4
N$16
  Top 0.254: R4.2 92.83,73.88 94.36,75.4 RN5.6 P0.5
N$17
  Top 0.254: R4.1 94.1,73.88 96.64,76.42 RN5.7 P0.6
N$18
  Top 0.254: R5.4 109.34,73.88 109.6,74.13 109.6,75.4 RN6.4 P1.3
N$19
  Top 0.254: R5.3 110.61,73.88 112.14,75.4 RN6.5 P1.4
N$20
  Top 0.254: R5.2 111.88,73.88 114.42,76.42 RN6.6 P1.5
N$21
  Top 0.254: R5.1 113.15,73.88 116.96,73.88 116.96,75.65 RN6.7 P1.6
N$22
  Top 0.254: MS.6 RN7.7 137.54,75.4 136.01,73.88 R6.1
N$23
  Top 0.254: MS.5 RN7.6 135,75.4 135,74.13 134.74,73.88 R6.2
N$24
  Top 0.254: MS.4 RN7.5 132.96,75.4 132.96,74.13 133.22,73.88 R6.3
N$25
  Top 0.254: MS.3 RN7.4 130.42,75.4 131.95,73.88 R6.4
N$26
  Top 0.254: MS.2 RN7.3 128.14,76.42 130.68,73.88 R6.5
N$27
  Top 0.254: MS.1 RN7.2 125.34,75.4 125.34,74.89 128.39,74.89 129.41,73.88 R6.6
P0  (via drill 0.61)
  Top 0.254: v107.82,32.22 107.82,33.24 107.06,33.24 U$1.41 | v88.01,32.73 88.01,57.62 86.99,58.64 86.99,66.26 87.5,66.76 R4.11
  Bottom 0.254: v107.82,32.22 107.31,32.73 v88.01,32.73
P0_1
  Top 0.254: R4.6 87.5,73.88 84.96,76.42 RN5.2 P0.1
P0_2
  Top 0.254: R4.5 88.77,73.88 87.24,75.4 RN5.3 P0.2
P1
  Top 0.254: U$1.42 106.29,32.47 104.01,32.47 104.01,40.09 104.52,40.6 104.52,44.16 104.01,44.67 104.01,57.11 105.02,58.13 105.02,65.24 106.55,66.76 R5.11
P1_5V
  Top 0.254: C11.P$2 25.78,41.62
  Top 0.508: 24.51,64.73 P1_PWR_PIN.4 | IC1.11 22.98,29.68 | 26.03,41.87 C11.P$2
  Top 0.61: IC1.9 22.98,29.68 24.51,31.2 24.51,32.73 26.03,32.73 26.03,41.87
  Top 1.27: C11.P$2 26.79,43.14 | 26.03,41.87 27.55,43.4 27.55,46.44 P1_POWER.4 27.55,51.02 27.55,61.68 24.51,64.73
  Bottom 0.508: 22.98,29.68 IC1.11
  Bottom 0.61: 16.89,34.25 IC1.6
  Bottom 1.27: 16.89,34.25 18.41,32.73 19.93,31.46 22.98,29.68
P1_12V  (via drill 0.61)
  Top 0.254: U11.1 9.01,15.2 | 13.84,15.2 U12.1 15.36,15.2 | 21.71,15.2 U13.1 20.19,15.2 | 26.54,15.2 U14.1 | 13.84,58.89 C14.+
  Top 1.016: 16.89,64.73 P1_PWR_PIN.1 | 9.27,15.2 v9.27,31.2
  Top 1.27: 9.01,15.2 9.27,15.2 13.84,15.2 | 21.71,15.2 26.54,15.2 | 15.36,15.2 20.19,15.2 | 13.84,49.49 13.84,35.78 IC1.4 | 16.89,64.73 13.84,61.68 13.84,58.89 13.84,49.49 | 13.84,49.49 12.31,49.49 P1_POWER.1
  Bottom 1.27: v9.27,31.2 9.27,47.97 10.79,47.97 P1_POWER.1
P2_5V
  Top 0.508: IC2.9 48.89,28.16
  Top 0.61: IC2.9 48.89,35.78
  Top 0.813: 54.99,41.87 C21.P$2
  Top 1.016: P2_PWR_PIN.4 56.51,60.16 P2_POWER1.4 56.51,43.4 54.99,41.87 54.99,40.35 53.46,40.35 48.89,35.78
  Top 1.27: IC2.9 IC2.11
  Bottom 0.508: IC2.6 45.84,32.73 45.84,31.2 47.37,31.2 48.89,29.68 IC2.9
P2_12V
  Top 0.254: U21.1 36.95,15.2 | 41.78,15.2 U22.1 | 50.92,15.2 U23.1 49.4,15.2 | 55.75,15.2 U24.1 | U22.1 43.3,15.2 | U22.1 42.54,15.96 | 41.27,58.89 C24.+
  Top 0.508: 42.79,66.26 P2_PWR_PIN.1 | 42.79,34.25 IC2.4 | U21.1 36.7,15.96
  Top 1.27: 36.95,15.2 41.78,15.2 | 50.92,15.2 55.75,15.2 | 43.3,15.2 49.4,15.2 | 42.79,66.26 41.27,64.73 41.27,58.89 P2_POWER1.1 41.27,38.82 | 42.79,34.25 41.27,35.78 41.27,38.82 | 36.7,15.96 36.7,34.25 41.27,38.82
P3_5V
  Top 0.508: 76.32,66.26 P3_PWR_PIN.4
  Top 0.813: 83.94,41.87 C31.P$2 | IC3.6 74.8,34.25
  Top 1.27: 83.94,41.87 85.47,43.4 85.47,46.44 P3_POWER1.4 85.47,51.02 80.89,55.59 80.89,60.16 | 76.32,66.26 80.89,61.68 80.89,60.16 | 74.8,34.25 73.27,35.78 73.27,52.54 80.89,60.16
  Bottom 0.508: 74.8,32.73 IC3.6
  Bottom 0.61: 74.8,32.73 74.8,31.2 77.85,31.2 | 77.85,31.2 79.37,29.68 80.89,29.68 IC3.11 | 77.85,31.2 77.85,29.68 IC3.9
P3_12V
  Top 0.254: U31.1 66.16,15.2 | 70.99,15.2 U32.1 72.51,15.2 | 78.86,15.2 U33.1 77.34,15.2 | 83.69,15.2 U34.1 | 68.83,58.51 C34.+
  Top 0.508: 68.7,66.26 P3_PWR_PIN.1 | IC3.4 71.75,34.25 | U32.1 71.75,15.96
  Top 0.61: 71.75,15.96 IC3.4
  Top 0.813: P3_POWER1.1 70.23,51.02
  Top 1.27: 66.16,15.2 70.99,15.2 | 78.86,15.2 83.69,15.2 | 72.51,15.2 77.34,15.2 | 68.7,66.26 68.7,58.64 68.83,58.51 70.23,57.11 70.23,51.02 | 71.75,34.25 70.23,35.78 70.23,46.44 P3_POWER1.1
P4
  Top 0.254: U$1.1 108.33,28.66 100.96,21.3 100.96,10.12 100.2,9.36 96.64,9.36 96.64,31.46 94.61,33.49 94.61,36.03 94.86,36.28 97.66,36.28 97.66,63.21 94.1,66.76 R4.16
P5  (via drill 0.61)
  Top 0.254: v109.09,39.08 109.09,29.43 U$1.2 | v113.41,42.89 113.41,47.71 112.64,48.48 112.64,66.51 112.9,66.76 R5.16
  Bottom 0.254: v109.09,39.08 112.9,42.89 v113.41,42.89
P8  (via drill 0.61)
  Top 0.254: v114.42,25.62 114.42,27.9 114.68,28.16 114.68,28.66 U$1.9 | v117.98,25.36 124.58,18.76 135.76,18.76 135.76,66.76 R6.16
  Bottom 0.254: v114.42,25.62 114.68,25.36 v117.98,25.36
P9  (via drill 0.61)
  Top 0.254: v115.44,27.65 115.44,28.66 U$1.10 | v105.53,28.66 101.47,32.73 v101.47,35.27 | v98.42,35.27 98.17,35.52 98.17,65.75 94.61,69.3 92.83,69.3 92.83,68.8 R4.15
  Bottom 0.254: v115.44,27.65 114.42,28.66 v105.53,28.66 | v98.42,35.27 v101.47,35.27
P10  (via drill 0.61)
  Top 0.254: v115.95,31.71 115.95,29.93 116.45,29.43 U$1.11 | v117.72,41.11 117.72,69.81 109.09,69.81 108.58,69.3 108.58,64.73 111.12,64.73 111.88,65.49 111.88,66.76 R5.15
  Bottom 0.254: v115.95,31.71 115.44,31.2 114.68,31.2 113.91,30.44 113.91,29.17 120.77,29.17 126.36,34.76 | 126.36,34.76 126.87,35.27 | v117.72,41.11 118.99,42.38 131.44,42.38 132.71,41.11 132.71,34.76 126.36,34.76
P13
  Top 0.254: U$1.14 118.49,32.47 120.26,32.47 120.26,37.05 132.96,49.75 132.96,65.24 134.49,66.76 R6.15
P14  (via drill 0.61)
  Top 0.254: v114.93,33.24 117.72,33.24 U$1.15 | v90.55,35.27 89.53,36.28 89.53,63.46 91.56,65.49 91.56,66.76 R4.14
  Bottom 0.254: v114.93,33.24 92.58,33.24 v90.55,35.27
P15  (via drill 0.61)
  Top 0.254: v120.77,60.41 120.77,38.32 119.76,37.3 119.76,34 118.49,34 U$1.16 | v110.87,65.75 110.61,66 110.61,66.76 R5.14
  Bottom 0.254: v120.77,60.41 115.44,65.75 v110.87,65.75
P18
  Top 0.254: U$1.21 118.49,38.06 119.76,38.06 119.76,63.46 125.6,69.3 133.22,69.3 133.22,68.8 R6.14
P19  (via drill 0.61)
  Top 0.254: v118.74,58.64 118.74,39.08 118.49,38.82 U$1.22 | v102.48,60.92 99.94,63.46 v99.94,66 | v90.55,65.75 90.29,66 90.29,66.76 R4.13
  Bottom 0.254: v118.74,58.64 116.45,60.92 v102.48,60.92 | v99.94,66 99.69,65.75 v90.55,65.75
P20
  Top 0.254: U$1.23 116.45,40.86 116.71,41.11 116.71,56.1 114.68,58.13 114.68,68.29 113.66,69.3 109.34,69.3 109.34,68.8 R5.13
P23  (via drill 0.61)
  Top 0.254: v114.68,39.33 113.91,40.09 U$1.26 | v122.3,44.16 130.42,52.29 130.42,65.24 131.95,66.76 R6.13
  Bottom 0.254: v114.68,39.33 119.5,44.16 v122.3,44.16
P24  (via drill 0.61)
  Top 0.254: v110.1,42.13 110.1,40.86 U$1.31 | v89.28,65.75 89.02,66 89.02,66.76 R4.12
  Bottom 0.254: v110.1,42.13 112.64,44.67 119.5,44.67 124.33,49.49 124.33,52.54 114.42,52.54 112.64,54.32 103.25,54.32 98.67,58.89 98.67,64.48 90.55,64.48 v89.28,65.75
P25
  Top 0.254: U$1.32 109.09,40.86 109.09,47.97 107.56,49.49 107.56,66.51 107.82,66.76 R5.12
P28  (via drill 0.61)
  Top 0.254: v106.04,45.68 106.04,44.67 105.53,44.16 105.53,38.06 106.29,38.06 U$1.35 | R1.2 98.93,20.28 99.44,20.79 99.44,45.17 101.21,46.95 IC4.6
  Bottom 0.254: v106.04,45.68 104.52,47.21 103.5,47.21 IC4.6
P29  (via drill 0.61)
  Top 0.254: R2.2 98.93,16.47 99.94,17.49 99.94,43.14 101.21,44.41 IC4.5 | v105.02,44.92 105.02,37.3 106.29,37.3 U$1.36 | v121.79,48.22 129.92,56.35 129.92,66 130.68,66.76 R6.12
  Bottom 0.254: IC4.5 v105.02,44.92 105.28,44.67 106.29,44.67 108.33,46.7 120.26,46.7 v121.79,48.22
P30  (via drill 0.61)
  Top 0.254: v105.02,35.78 105.02,36.28 106.29,36.28 U$1.37
  Bottom 0.254: v105.02,35.78 104.52,36.28 90.29,36.28 86.99,32.98 86.99,31.71 104.26,31.71 104.77,32.22 106.55,32.22 107.56,31.2 113.91,31.2 114.93,32.22 115.18,32.22 117.22,34.25 117.22,35.52 116.71,35.52 115.95,36.28 115.95,37.55 128.65,37.55 128.9,37.3 131.44,37.3 132.2,38.06 132.2,40.6 131.44,40.6 PROP_PLUG.4
P31  (via drill 0.61)
  Top 0.254: v108.07,37.81 108.07,35.52 107.06,35.52 U$1.38
  Bottom 0.254: v108.07,37.81 108.33,38.06 128.9,38.06 PROP_PLUG.3
PWM1  (via drill 0.61)
  Top 0.254: v109.85,3.77 109.85,19.77 110.61,20.54 110.61,28.41 110.87,28.66 U$1.4
  Bottom 0.254: v109.85,3.77 109.34,3.26 90.8,3.26 90.55,3.01 41.78,3.01 16.38,28.41 IC1.5
PWM2  (via drill 0.61)
  Top 0.254: v113.41,9.87 113.41,11.39 114.68,12.66 114.68,20.28 116.96,22.57 116.96,30.95 117.47,31.46 117.72,31.46 U$1.13
  Bottom 0.254: IC1.10 22.73,33.49 23.49,32.73 24.76,32.73 24.76,28.41 44.57,8.6 100.45,8.6 100.45,5.3 101.98,3.77 108.83,3.77 108.83,5.3 v113.41,9.87
PWM3  (via drill 0.61)
  Top 0.254: v113.91,37.05 113.91,37.55 117.22,37.55 117.47,37.3 117.72,37.3 U$1.20 | v76.32,36.28 74.8,37.81 v74.8,38.32
  Bottom 0.254: IC2.5 43.81,34.76 46.86,37.81 74.29,37.81 v74.8,38.32 | v113.91,37.05 113.66,36.79 76.83,36.79 v76.32,36.28
PWM4  (via drill 0.61)
  Top 0.254: v51.43,23.33 47.62,27.14 47.62,30.95 46.35,32.22 46.35,35.27 v46.1,35.52 | v113.66,52.03 113.66,48.22 113.91,47.97 113.91,45.43 114.68,44.67 114.68,40.86 U$1.25 | v100.71,53.81 99.44,55.08 99.44,65.24 93.34,71.34 76.83,71.34 76.83,78.19 76.07,78.96 47.87,78.96 47.87,69.3 48.64,68.54 52.7,68.54 52.7,65.24 58.29,59.65 58.29,42.38 50.67,34.76 IC2.10
  Bottom 0.254: v46.1,35.52 48.89,35.52 49.65,34.76 IC2.10 | v113.66,52.03 111.88,53.81 v100.71,53.81
PWM5  (via drill 0.61)
  Top 0.254: v106.55,39.84 106.55,38.82 U$1.34 | v94.61,39.84 93.09,38.32 v93.09,27.65
  Bottom 0.254: IC3.5 73.53,27.14 74.29,26.38 91.82,26.38 v93.09,27.65 | v94.61,39.84 v106.55,39.84
PWM6  (via drill 0.61)
  Top 0.254: v105.53,29.93 106.29,30.7 U$1.44
  Bottom 0.254: v105.53,29.93 105.28,30.19 86.48,30.19 86.23,30.44 81.66,30.44
  Bottom 0.813: 81.66,30.44 79.88,32.22 IC3.10
RES  (via drill 0.61)
  Top 0.254: v113.41,27.65 113.41,28.41 113.15,28.66 U$1.7 | PROP_PLUG.2 128.9,35.52 125.85,32.47 125.85,27.39 RESET.P$1 125.34,25.87 125.34,21.04 RESET.P$2
  Bottom 0.254: v113.41,27.65 114.42,26.63 124.58,26.63 RESET.P$1
SEN_1
  Bottom 0.254: IC1.1 10.79,36.03 12.06,37.3 24.76,37.3 48.13,60.67 82.16,60.67 82.67,61.18 SEN_EN.1
SEN_2  (via drill 0.61)
  Top 0.254: v29.33,67.53 29.84,67.02 29.84,31.71 29.08,30.95 IC1.15
  Bottom 0.254: v29.33,67.53 34.16,62.7 84.2,62.7 85.21,61.68 SEN_EN.3
SEN_3  (via drill 0.61)
  Top 0.254: v43.3,63.72 43.05,63.46 43.05,35.52 43.81,34.76 43.81,32.22 42.03,30.44 39.24,30.44 39.24,29.68 IC2.1
  Bottom 0.254: v43.3,63.72 85.72,63.72 87.75,61.68 SEN_EN.5
SEN_4  (via drill 0.61)
  Top 0.254: v59.3,51.27 58.8,50.76 v58.8,31.46
  Bottom 0.254: v59.3,51.27 68.19,60.16 89.28,60.16 90.29,61.18 SEN_EN.7 | v58.8,31.46 57.02,29.68 IC2.15
SEN_5  (via drill 0.61)
  Top 0.254: v92.07,25.36 92.07,59.91 93.09,60.92 SEN_EN.9
  Bottom 0.254: v92.07,25.36 91.56,25.87 69.72,25.87 68.45,27.14 IC3.1
SEN_6
  Top 0.254: SEN_EN.11 95.63,61.94 92.07,65.49 92.07,69.3 84.45,69.3 84.45,53.81 87.5,50.76 87.5,40.6 85.21,38.32 85.21,38.06 83.18,36.03 83.18,31.71 85.21,29.68 IC3.15
VCC3.3V2  (via drill 0.61)
  Top 0.254: v100.96,40.86 100.45,40.35 100.45,12.15 99.94,11.65 X1.2
  Bottom 0.254: v100.96,40.86 92.83,40.86 92.83,50.51 93.34,51.02 99.69,51.02 100.96,52.29 IC4.8